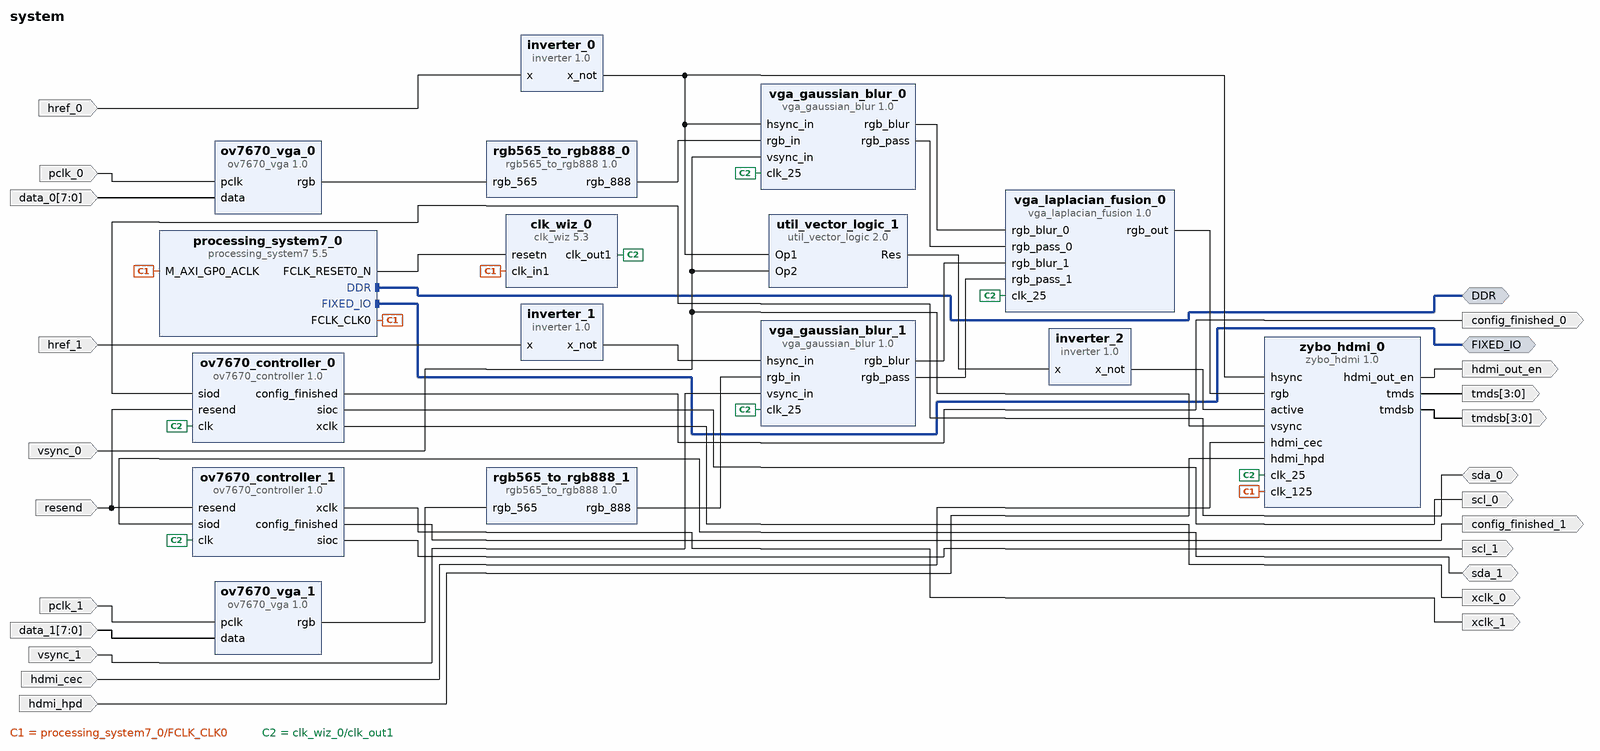
[diagram p0: block diagram of the top level]
# Vivado block design system, xc7z010clg400-1, Vivado 2016.4
create_bd_design system

create_bd_intf_port -mode Master -vlnv xilinx.com:interface:ddrx_rtl:1.0 DDR
create_bd_intf_port -mode Master -vlnv xilinx.com:display_processing_system7:fixedio_rtl:1.0 FIXED_IO
create_bd_port -dir I pclk_0
create_bd_port -dir I pclk_1
create_bd_port -dir I -from 7 -to 0 data_0
create_bd_port -dir I -from 7 -to 0 data_1
create_bd_port -dir O -from 3 -to 0 tmds
create_bd_port -dir O -from 3 -to 0 tmdsb
create_bd_port -dir O hdmi_out_en
create_bd_port -dir I resend
create_bd_port -dir O config_finished_0
create_bd_port -dir O scl_0
create_bd_port -dir IO sda_0
create_bd_port -dir O xclk_0
create_bd_port -dir O xclk_1
create_bd_port -dir O config_finished_1
create_bd_port -dir O scl_1
create_bd_port -dir IO sda_1
create_bd_port -dir I href_0
create_bd_port -dir I href_1
create_bd_port -dir I vsync_0
create_bd_port -dir I vsync_1
create_bd_port -dir I hdmi_cec
create_bd_port -dir I hdmi_hpd

create_bd_cell -type ip -vlnv xilinx.com:ip:processing_system7:5.5 processing_system7_0
set_property -dict [list \
  CONFIG.PCW_UIPARAM_DDR_FREQ_MHZ 525 \
  CONFIG.PCW_CRYSTAL_PERIPHERAL_FREQMHZ 50.000000 \
  CONFIG.PCW_APU_PERIPHERAL_FREQMHZ 650 \
  CONFIG.PCW_SDIO_PERIPHERAL_FREQMHZ 50 \
  CONFIG.PCW_FPGA0_PERIPHERAL_FREQMHZ 125 \
  CONFIG.PCW_PRESET_BANK1_VOLTAGE {LVCMOS 1.8V} \
  CONFIG.PCW_UIPARAM_DDR_PARTNO {MT41K128M16 JT-125} \
  CONFIG.PCW_QSPI_PERIPHERAL_ENABLE 1 \
  CONFIG.PCW_QSPI_GRP_SINGLE_SS_ENABLE 1 \
  CONFIG.PCW_QSPI_GRP_FBCLK_ENABLE 1 \
  CONFIG.PCW_ENET0_PERIPHERAL_ENABLE 1 \
  CONFIG.PCW_ENET0_ENET0_IO {MIO 16 .. 27} \
  CONFIG.PCW_ENET0_GRP_MDIO_ENABLE 1 \
  CONFIG.PCW_ENET0_RESET_ENABLE 0 \
  CONFIG.PCW_SD0_PERIPHERAL_ENABLE 1 \
  CONFIG.PCW_SD0_GRP_CD_ENABLE 1 \
  CONFIG.PCW_SD0_GRP_CD_IO {MIO 47} \
  CONFIG.PCW_SD0_GRP_WP_ENABLE 1 \
  CONFIG.PCW_UART1_PERIPHERAL_ENABLE 1 \
  CONFIG.PCW_TTC0_PERIPHERAL_ENABLE 1 \
  CONFIG.PCW_USB0_PERIPHERAL_ENABLE 1 \
  CONFIG.PCW_USB0_RESET_ENABLE 1 \
  CONFIG.PCW_USB0_RESET_IO {MIO 46} \
  CONFIG.PCW_GPIO_MIO_GPIO_ENABLE 1 \
] [get_bd_cells processing_system7_0]
# 105 more settings of processing_system7_0 are not shown: defaults, MIO pin electricals, DDR timing, and values the tool derives
create_bd_cell -type ip -vlnv xilinx.com:user:ov7670_vga:1.0 ov7670_vga_0
create_bd_cell -type ip -vlnv xilinx.com:user:ov7670_vga:1.0 ov7670_vga_1
create_bd_cell -type ip -vlnv xilinx.com:user:ov7670_controller:1.0 ov7670_controller_0
create_bd_cell -type ip -vlnv xilinx.com:user:ov7670_controller:1.0 ov7670_controller_1
create_bd_cell -type ip -vlnv xilinx.com:user:rgb565_to_rgb888:1.0 rgb565_to_rgb888_0
create_bd_cell -type ip -vlnv xilinx.com:user:rgb565_to_rgb888:1.0 rgb565_to_rgb888_1
create_bd_cell -type ip -vlnv xilinx.com:ip:clk_wiz:5.3 clk_wiz_0
set_property -dict [list \
  CONFIG.CLKOUT1_REQUESTED_OUT_FREQ 25 \
  CONFIG.RESET_PORT resetn \
  CONFIG.MMCM_DIVCLK_DIVIDE 5 \
  CONFIG.MMCM_CLKFBOUT_MULT_F 36.500 \
  CONFIG.MMCM_CLKOUT0_DIVIDE_F 36.500 \
  CONFIG.RESET_TYPE ACTIVE_LOW \
  CONFIG.CLKOUT1_JITTER 312.659 \
  CONFIG.CLKOUT1_PHASE_ERROR 245.713 \
] [get_bd_cells clk_wiz_0]
create_bd_cell -type ip -vlnv xilinx.com:user:zybo_hdmi:1.0 zybo_hdmi_0
create_bd_cell -type ip -vlnv user.org:user:inverter:1.0 inverter_0
create_bd_cell -type ip -vlnv user.org:user:inverter:1.0 inverter_1
create_bd_cell -type ip -vlnv xilinx.com:ip:util_vector_logic:2.0 util_vector_logic_1
set_property -dict {CONFIG.C_SIZE 1 CONFIG.C_OPERATION or} [get_bd_cells util_vector_logic_1]
create_bd_cell -type ip -vlnv user.org:user:inverter:1.0 inverter_2
create_bd_cell -type ip -vlnv xilinx.com:user:vga_gaussian_blur:1.0 vga_gaussian_blur_0
create_bd_cell -type ip -vlnv xilinx.com:user:vga_gaussian_blur:1.0 vga_gaussian_blur_1
create_bd_cell -type ip -vlnv xilinx.com:user:vga_laplacian_fusion:1.0 vga_laplacian_fusion_0

# ---- connections ----

connect_bd_intf_net [get_bd_intf_ports DDR] [get_bd_intf_pins processing_system7_0/DDR]
connect_bd_intf_net [get_bd_intf_ports FIXED_IO] [get_bd_intf_pins processing_system7_0/FIXED_IO]
connect_bd_net [get_bd_pins ov7670_vga_1/rgb] [get_bd_pins rgb565_to_rgb888_1/rgb_565]
connect_bd_net [get_bd_pins ov7670_vga_0/rgb] [get_bd_pins rgb565_to_rgb888_0/rgb_565]
connect_bd_net [get_bd_pins processing_system7_0/FCLK_CLK0] \
  [get_bd_pins processing_system7_0/M_AXI_GP0_ACLK] [get_bd_pins clk_wiz_0/clk_in1] [get_bd_pins zybo_hdmi_0/clk_125]
connect_bd_net [get_bd_pins processing_system7_0/FCLK_RESET0_N] [get_bd_pins clk_wiz_0/resetn]
connect_bd_net [get_bd_pins clk_wiz_0/clk_out1] \
  [get_bd_pins ov7670_controller_1/clk] [get_bd_pins ov7670_controller_0/clk] [get_bd_pins zybo_hdmi_0/clk_25] \
  [get_bd_pins vga_gaussian_blur_0/clk_25] [get_bd_pins vga_gaussian_blur_1/clk_25] \
  [get_bd_pins vga_laplacian_fusion_0/clk_25]
connect_bd_net [get_bd_ports pclk_0] [get_bd_pins ov7670_vga_0/pclk]
connect_bd_net -net pclk_1_1 [get_bd_ports pclk_1] [get_bd_pins ov7670_vga_1/pclk]
connect_bd_net [get_bd_ports data_0] [get_bd_pins ov7670_vga_0/data]
connect_bd_net -net data_1_1 [get_bd_ports data_1] [get_bd_pins ov7670_vga_1/data]
connect_bd_net [get_bd_pins zybo_hdmi_0/tmds] [get_bd_ports tmds]
connect_bd_net [get_bd_pins zybo_hdmi_0/tmdsb] [get_bd_ports tmdsb]
connect_bd_net [get_bd_pins zybo_hdmi_0/hdmi_out_en] [get_bd_ports hdmi_out_en]
connect_bd_net [get_bd_ports resend] [get_bd_pins ov7670_controller_0/resend] [get_bd_pins ov7670_controller_1/resend]
connect_bd_net [get_bd_pins ov7670_controller_0/config_finished] [get_bd_ports config_finished_0]
connect_bd_net [get_bd_pins ov7670_controller_0/sioc] [get_bd_ports scl_0]
connect_bd_net [get_bd_ports sda_0] [get_bd_pins ov7670_controller_0/siod]
connect_bd_net [get_bd_pins ov7670_controller_0/xclk] [get_bd_ports xclk_0]
connect_bd_net [get_bd_pins ov7670_controller_1/xclk] [get_bd_ports xclk_1]
connect_bd_net [get_bd_pins ov7670_controller_1/config_finished] [get_bd_ports config_finished_1]
connect_bd_net [get_bd_pins ov7670_controller_1/sioc] [get_bd_ports scl_1]
connect_bd_net [get_bd_ports sda_1] [get_bd_pins ov7670_controller_1/siod]
connect_bd_net [get_bd_pins rgb565_to_rgb888_1/rgb_888] [get_bd_pins vga_gaussian_blur_1/rgb_in]
connect_bd_net -net href_0_1 [get_bd_ports href_0] [get_bd_pins inverter_0/x]
connect_bd_net [get_bd_pins inverter_0/x_not] \
  [get_bd_pins vga_gaussian_blur_0/hsync_in] [get_bd_pins util_vector_logic_1/Op1] [get_bd_pins zybo_hdmi_0/hsync]
connect_bd_net -net href_1_1 [get_bd_ports href_1] [get_bd_pins inverter_1/x]
connect_bd_net [get_bd_pins inverter_1/x_not] [get_bd_pins vga_gaussian_blur_1/hsync_in]
connect_bd_net -net vsync_0_1 [get_bd_ports vsync_0] \
  [get_bd_pins vga_gaussian_blur_0/vsync_in] [get_bd_pins util_vector_logic_1/Op2] [get_bd_pins zybo_hdmi_0/vsync]
connect_bd_net -net vsync_1_1 [get_bd_ports vsync_1] [get_bd_pins vga_gaussian_blur_1/vsync_in]
connect_bd_net [get_bd_pins util_vector_logic_1/Res] [get_bd_pins inverter_2/x]
connect_bd_net [get_bd_ports hdmi_cec] [get_bd_pins zybo_hdmi_0/hdmi_cec]
connect_bd_net [get_bd_ports hdmi_hpd] [get_bd_pins zybo_hdmi_0/hdmi_hpd]
connect_bd_net [get_bd_pins inverter_2/x_not] [get_bd_pins zybo_hdmi_0/active]
connect_bd_net [get_bd_pins rgb565_to_rgb888_0/rgb_888] [get_bd_pins vga_gaussian_blur_0/rgb_in]
connect_bd_net [get_bd_pins vga_gaussian_blur_0/rgb_blur] [get_bd_pins vga_laplacian_fusion_0/rgb_blur_0]
connect_bd_net [get_bd_pins vga_gaussian_blur_0/rgb_pass] [get_bd_pins vga_laplacian_fusion_0/rgb_pass_0]
connect_bd_net [get_bd_pins vga_gaussian_blur_1/rgb_blur] [get_bd_pins vga_laplacian_fusion_0/rgb_blur_1]
connect_bd_net [get_bd_pins vga_gaussian_blur_1/rgb_pass] [get_bd_pins vga_laplacian_fusion_0/rgb_pass_1]
connect_bd_net [get_bd_pins vga_laplacian_fusion_0/rgb_out] [get_bd_pins zybo_hdmi_0/rgb]

validate_bd_design
save_bd_design
